# Altium schematic sheet optoiso.SchDoc
size A
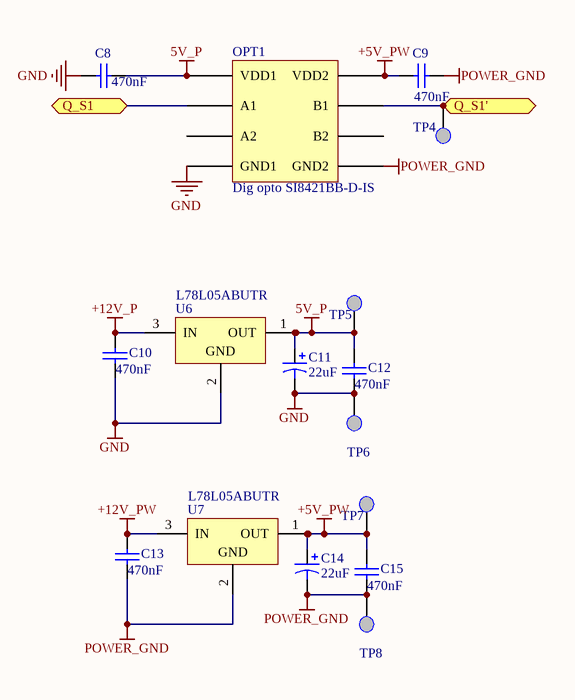
[diagram p0: optoiso.SchDoc]

## Parts
C8  value 470nF  [Capacitor 0805]  (hidden comment: Cap)
C9  value 470nF  [Capacitor 0805]  (hidden comment: Cap)
C10  value 470nF  [Capacitor 0805]  (hidden comment: Cap)
C11  value 22uF  [Cap Tantal 3216]  (hidden comment: Tantalium/T520A226M006ATE090)
C12  value 470nF  [Capacitor 0805]  (hidden comment: Cap)
C13  value 470nF  [Capacitor 0805]  (hidden comment: Cap)
C14  value 22uF  [Cap Tantal 3216]  (hidden comment: Tantalium/T520A226M006ATE090)
C15  value 470nF  [Capacitor 0805]  (hidden comment: Cap)
OPT1  Dig opto SI8421BB-D-IS  [SO8 TS27l2]
TP4  Test point  [Test Point]  (value not drawn)
TP5  Test point  [Test Point]  (value not drawn)
TP6  Test point  [Test Point]  (value not drawn)
TP7  Test point  [Test Point]  (value not drawn)
TP8  Test point  [Test Point]  (value not drawn)
U6  L78L05ABUTR  [Reg SOT-89 +5]
U7  L78L05ABUTR  [Reg SOT-89 +5]

## Ports
Q_S1, Q_S1'

## Nets
5V_P: C8.1 C11.1 C12.2 OPT1.1(VDD1) TP5.1 U6.1(OUT)
+5V_PW: C9.1 C14.1 C15.2 OPT1.8(VDD2) TP7.1 U7.1(OUT)
+12V_P: C10.2 U6.3(IN)
+12V_PW: C13.2 U7.3(IN)
GND: C8.2 C10.1 C11.2 C12.1 OPT1.4(GND1) TP6.1 U6.2(GND)
POWER_GND: C9.2 C13.1 C14.2 C15.1 OPT1.5(GND2) TP8.1 U7.2(GND)
Q_S1: OPT1.2(A1) ; port Q_S1
Q_S1': OPT1.7(B1) TP4.1 ; port Q_S1'

Not connected (* = marked no-connect by the designer): OPT1 3(A2) 6(B2)

## Library data of the parts
C8-C10 C12 C13 C15 = Cap: Capacitor; Published: 8-Jun-2000; LatestRevisionDate: 17-Jul-2002; LatestRevisionNote: Re-released for DXP Platform.; PackageReference: RAD-0.3; Publisher: Altium Limited
C11 C14 = Cap Pol1: Polarized Capacitor (Radial); Published: 8-Jun-2000; LatestRevisionDate: 17-Jul-2002; LatestRevisionNote: Re-released for DXP Platform.; PackageReference: RB7.6-15; Publisher: Altium Limited
OPT1 = Component_1
U6 U7 = L78L05ABZ: Positive Voltage Regulator; Published: 24-Aug-2001; LatestRevisionDate: 17-Jul-2002; LatestRevisionNote: Re-released for DXP Platform.; DatasheetVersion: Feb-1999; PackageReference: TO92; Publisher: Altium Limited; PackageDescription: TO, Flat Index; 3 In-Line, Axial Leads; Body Dia. 4.8mm; Leads 0.51 x 0.51 mm (max); ComponentLink1Description: Manufacturer Link; ComponentLink1URL: http://www.st.com/